# Altium schematic sheet AD603_PGA.SchDoc
size A4; SheetNumber: 5; SheetTotal: 9
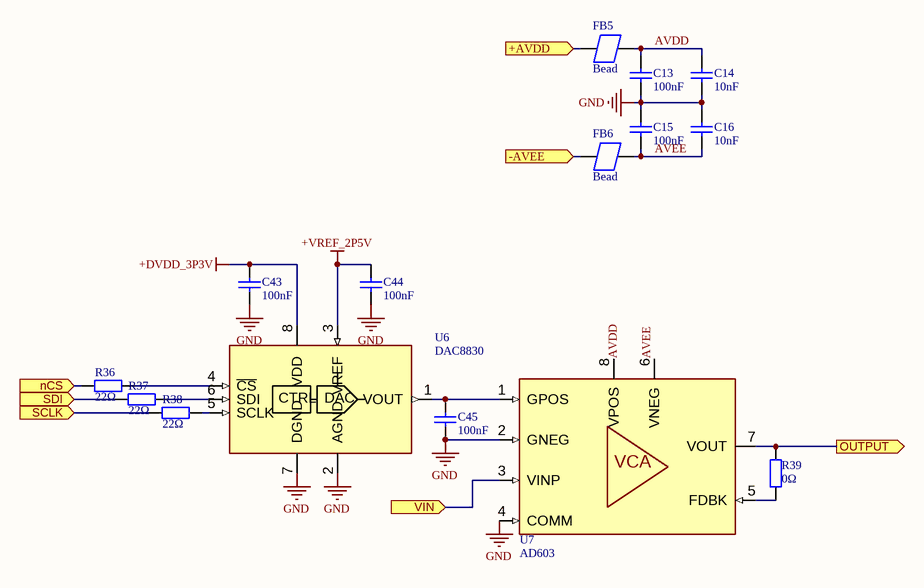
[diagram p0: AD603_PGA.SchDoc]

## Parts
C13  100nF  [0603_C]
C14  10nF  [0603_C]
C15  100nF  [0603_C]
C16  10nF  [0603_C]
C43  100nF  [0603_C]
C44  100nF  [0603_C]
C45  100nF  [0603_C]
FB5  Bead  [0805_L]
FB6  Bead  [0805_L]
R36  22Ω  [0603_R]
R37  22Ω  [0603_R]
R38  22Ω  [0603_R]
R39  0Ω  [0603_R]
U6  DAC8830  [SOIC127P600X175-8M]
U7  AD603  [SOIC127P600X175-8M]

## Ports
+AVDD (in), -AVEE (in), nCS (in), OUTPUT (out), SCLK (in), SDI (in), VIN (in)

## Nets
+DVDD_3P3V: C43.2 U6.8(VDD)
+VREF_2P5V: C44.2 U6.3(VREF)
GND: C13.1 C14.1 C15.1 C16.1 C43.1 C44.1 C45.1 U6.2(AGND) U6.7(DGND) U7.2(GNEG) U7.4(COMM)
+AVDD: FB5.1 ; port +AVDD
-AVEE: FB6.1 ; port -AVEE
AVDD: C13.2 C14.2 FB5.2
AVEE: C15.2 C16.2 FB6.2 U7.6(VNEG)
nCS: R36.1 ; port nCS
OUTPUT: R39.2 U7.7(VOUT) ; port OUTPUT
SCLK: R38.1 ; port SCLK
SDI: R37.1 ; port SDI
VIN: U7.3(VINP) ; port VIN
NetC45_2: C45.2 U6.1(VOUT) U7.1(GPOS)
NetR36_2: R36.2 U6.4(~{CS})
NetR37_2: R37.2 U6.6(SDI)
NetR38_2: R38.2 U6.5(SCLK)
NetR39_1: R39.1 U7.5(FDBK)

Not connected (* = marked no-connect by the designer): U7 8(VPOS)

## Notes on the sheet
- Labels drawn without touching a wire or pin: AVDD
- (in symbol AD603) VCA
- (in symbol DAC8830) CTRL; DAC

## Library data of the parts
C13 C15 C43-C45 = 0603 100nF (104) 10% 50V: 贴片电容; ComponentLink1Description: 供应商链接; ComponentLink1URL: http://www.szlcsc.com/product/details_15331.html; Package: 0603; Supplier: LC; SuppliersPartNumber: C14663
C14 C16 = 0603 10nF (103) 10% 50V: 贴片电容; ComponentLink1Description: 供应商链接; ComponentLink1URL: http://www.szlcsc.com/product/details_58143.html; Package: 0603; Supplier: LC; SuppliersPartNumber: C57112
R36-R38 = 0603 22Ω (22R0) 1%: 贴片电阻; ComponentLink1Description: 供应商链接; ComponentLink1URL: http://www.szlcsc.com/product/details_24078.html; Package: 0603; Supplier: LC; SuppliersPartNumber: C23345
R39 = 0603 0Ω (0R0) 1%: 贴片电阻; ComponentLink1Description: 供应商链接; ComponentLink1URL: http://www.szlcsc.com/product/details_21903.html; Package: 0603; Supplier: LC; SuppliersPartNumber: C21189